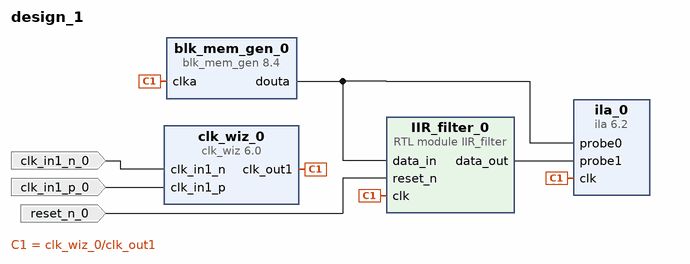
[diagram p0: block diagram of the top level]
# Vivado block design design_1, xczu7ev-ffvc1156-2-e, Vivado 2019.1
create_bd_design design_1

create_bd_port -dir I -type clk clk_in1_n_0
create_bd_port -dir I -type clk clk_in1_p_0
create_bd_port -dir I -type rst reset_n_0

create_bd_cell -type ip -vlnv xilinx.com:ip:blk_mem_gen:8.4 blk_mem_gen_0
set_property -dict [list \
  CONFIG.Coe_File {../../../../../../../../DSP_Theory_dr_Mohamed_Moataz/MATLAB/IIR filter ref model/input_samples.coe} \
  CONFIG.Enable_32bit_Address false \
  CONFIG.Enable_A Always_Enabled \
  CONFIG.Load_Init_File true \
  CONFIG.Memory_Type Single_Port_ROM \
  CONFIG.Port_A_Write_Rate 0 \
  CONFIG.Register_PortA_Output_of_Memory_Primitives false \
  CONFIG.Use_RSTA_Pin false \
  CONFIG.Write_Depth_A 1000 \
  CONFIG.Write_Width_A 8 \
  CONFIG.use_bram_block Stand_Alone \
] [get_bd_cells blk_mem_gen_0]
create_bd_cell -type module -reference IIR_filter IIR_filter_0
create_bd_cell -type ip -vlnv xilinx.com:ip:clk_wiz:6.0 clk_wiz_0
set_property -dict [list \
  CONFIG.CLKIN1_JITTER_PS 80.0 \
  CONFIG.CLKOUT1_JITTER 261.444 \
  CONFIG.CLKOUT1_PHASE_ERROR 222.305 \
  CONFIG.CLKOUT1_REQUESTED_OUT_FREQ 10.000 \
  CONFIG.MMCM_CLKFBOUT_MULT_F 48.000 \
  CONFIG.MMCM_CLKIN1_PERIOD 8.000 \
  CONFIG.MMCM_CLKOUT0_DIVIDE_F 120.000 \
  CONFIG.MMCM_DIVCLK_DIVIDE 5 \
  CONFIG.PRIM_IN_FREQ 125.000 \
  CONFIG.PRIM_SOURCE Differential_clock_capable_pin \
  CONFIG.USE_LOCKED false \
  CONFIG.USE_RESET false \
] [get_bd_cells clk_wiz_0]
create_bd_cell -type ip -vlnv xilinx.com:ip:ila:6.2 ila_0
set_property -dict [list \
  CONFIG.C_DATA_DEPTH 16384 \
  CONFIG.C_ENABLE_ILA_AXI_MON false \
  CONFIG.C_MONITOR_TYPE Native \
  CONFIG.C_NUM_OF_PROBES 3 \
  CONFIG.C_PROBE0_WIDTH 8 \
  CONFIG.C_PROBE1_WIDTH 17 \
  CONFIG.C_PROBE2_WIDTH 17 \
] [get_bd_cells ila_0]

# ---- connections ----

connect_bd_net -net clk_in1_n_0_1 [get_bd_ports clk_in1_n_0] [get_bd_pins clk_wiz_0/clk_in1_n]
connect_bd_net -net clk_in1_p_0_1 [get_bd_ports clk_in1_p_0] [get_bd_pins clk_wiz_0/clk_in1_p]
connect_bd_net [get_bd_pins clk_wiz_0/clk_out1] [get_bd_pins IIR_filter_0/clk] [get_bd_pins blk_mem_gen_0/clka] [get_bd_pins ila_0/clk]
connect_bd_net [get_bd_pins blk_mem_gen_0/douta] [get_bd_pins IIR_filter_0/data_in] [get_bd_pins ila_0/probe0]
connect_bd_net [get_bd_pins IIR_filter_0/data_out] [get_bd_pins ila_0/probe1]
connect_bd_net -net reset_n_0_1 [get_bd_ports reset_n_0] [get_bd_pins IIR_filter_0/reset_n]

validate_bd_design
save_bd_design
